# Altium schematic sheet output.SchDoc
size A3
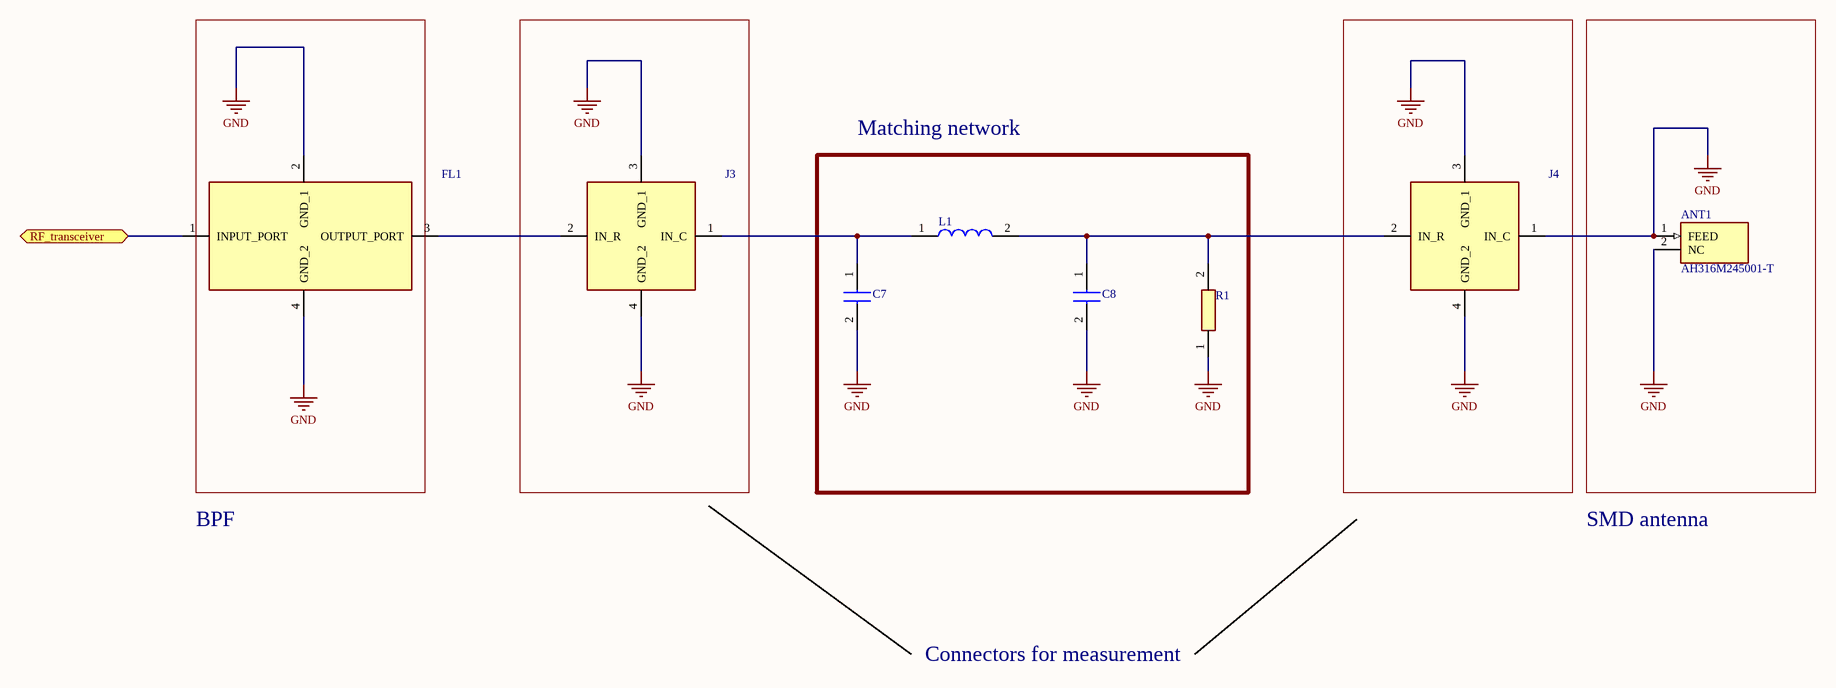
[diagram p0: output.SchDoc]

## Parts
ANT1  AH316M245001-T  [ANTC3216X60N]
C7  GRM1555C1HR50BA01D  [CAPC1005X55N]  (value not drawn)
C8  GRM1555C1HR50BA01D  [CAPC1005X55N]  (value not drawn)
FL1  DEA202450BT-1294D1-H  [DEA202450BT1294D1H]  (value not drawn)
J3  MM8030-2610RJ3  [MM80302610RJ3]  (value not drawn)
J4  MM8030-2610RJ3  [MM80302610RJ3]  (value not drawn)
L1  LQG15HS3N3S02D  [LQG15WH0N7B02D]  (value not drawn)
R1  CH0402-50RGFPT  [RESC1006X63N]  (value not drawn)

## Blocks framed on the sheet
Matching network: C7 C8 L1 R1

## Ports
RF_transceiver (bidir)

## Nets
GND: ANT1.1(FEED) ANT1.2(NC) C7.2 C8.2 FL1.2(GND_1) FL1.4(GND_2) J3.3(GND_1) J3.4(GND_2) J4.1(IN_C) J4.3(GND_1) J4.4(GND_2) R1.1
RF_transceiver: FL1.1(INPUT_PORT) ; port RF_transceiver
NetC7_1: C7.1 J3.1(IN_C) L1.1
NetC8_1: C8.1 J4.2(IN_R) L1.2 R1.2
NetFL1_3: FL1.3(OUTPUT_PORT) J3.2(IN_R)

## Notes on the sheet
- BPF
- SMD antenna
- Connectors for measurement
- Title
- Size:
- Date:
- A3
- Number:
- Time:
- Revision:
- Sheet
- of
- File:

## Library data of the parts
ANT1 = AH316M245001-T: Antenna; Manufacturer_Name: TAIYO YUDEN; Datasheet Link: http://www.mouser.com/ds/2/396/chipantenna01_e-587795.pdf; Height: 0.6mm; Manufacturer_Part_Number: AH316M245001-T; Mouser Part Number: 963-AH316M245001-T; Mouser Price/Stock: https://www.mouser.co.uk/ProductDetail/Taiyo-Yuden/AH316M245001-T?qs=I6KAKw0tg2zXv3bNBw9dFQ%3D%3D
C7 C8 = GRM1555C1HR50BA01D: Capacitor; Manufacturer_Name: Murata Electronics; Datasheet Link: https://datasheet.datasheetarchive.com/originals/distributors/Datasheets_SAMA/ec4f1577dddcc7a13ddad897a28002d3.pdf; Height: 0.55mm; Manufacturer_Part_Number: GRM1555C1HR50BA01D; Mouser Part Number: 81-GRM1555C1HR50BA1D; Mouser Price/Stock: https://www.mouser.co.uk/ProductDetail/Murata-Electronics/GRM1555C1HR50BA01D?qs=e%252BE4OD6MgMeKFfJD3AEN3Q%3D%3D; Arrow Part Number: GRM1555C1HR50BA01D; Arrow Price/Stock: https://www.arrow.com/en/products/grm1555c1hr50ba01d/murata-manufacturing
FL1 = DEA202450BT-1294D1-H: Filter; Manufacturer_Name: TDK; Datasheet Link: https://www.mouser.com/catalog/specsheets/TDK_DEA202450BT_1294D1_H_ver1_0.pdf; Height: 0.8mm; Manufacturer_Part_Number: DEA202450BT-1294D1-H; Mouser Part Number: 810-DEA202450BT1294D; Mouser Price/Stock: https://www.mouser.co.uk/ProductDetail/TDK/DEA202450BT-1294D1-H?qs=W%2FMpXkg%252BdQ4stfqD0qqbsg%3D%3D
J3 J4 = MM8030-2610RJ3: Connector; Manufacturer_Name: Murata Electronics; Datasheet Link: https://componentsearchengine.com//MM8030-2610RJ3.pdf; Height: 1mm; Mouser2 Part Number: 81-MM8030-2610RJ3; Mouser2 Price/Stock: https://www.mouser.com/Search/Refine.aspx?Keyword=81-MM8030-2610RJ3; Manufacturer_Part_Number: MM8030-2610RJ3
L1 = LQG15HS3N3S02D: Inductor; Manufacturer_Name: Murata Electronics; Datasheet Link: https://psearch.en.murata.com/inductor/product/LQG15HS3N3S02%23.html; Height: 0.55mm; Manufacturer_Part_Number: LQG15HS3N3S02D; Mouser Part Number: 81-LQG15HS3N3S02D; Mouser Price/Stock: https://www.mouser.co.uk/ProductDetail/Murata-Electronics/LQG15HS3N3S02D?qs=ctz47l0uL1AsjFUyMRD%2FGA%3D%3D; Arrow Part Number: LQG15HS3N3S02D; Arrow Price/Stock: https://www.arrow.com/en/products/lqg15hs3n3s02d/murata-manufacturing?region=nac
R1 = CH0402-50RGFPT: Resistor; Manufacturer_Name: Vishay; Datasheet Link: http://www.vishay.com/docs/53014/ch.pdf; Height: 0.627mm; Manufacturer_Part_Number: CH0402-50RGFPT; Mouser Part Number: 71-CH0402-50RGFPT; Mouser Price/Stock: https://www.mouser.co.uk/ProductDetail/Vishay-Sfernice/CH0402-50RGFPT?qs=zR8VgEwoOb306akMd%2FOkng%3D%3D; Arrow Part Number: CH0402-50RGFPT; Arrow Price/Stock: https://www.arrow.com/en/products/ch0402-50rgfpt/vishay